# Altium schematic sheet Revision History.SchDoc: Title
size A3; Date: *******; ApprovedBy: *******; CheckedBy: None; Author: *******; CompanyName: *******; DrawnBy: Name; Engineer: *******; Organization: *******; Address1: *******; Address2: *******; Address3: *******; Address4: *******; DocumentNumber: Doc Num; Revision: *******; SheetNumber: 1; SheetTotal: *******; CurrentTime: *******; CurrentDate: *******; Time: *******; DocumentFullPathAndName: *******; DocumentName: *******; ModifiedDate: *******; ImagePath: *******; ProjectName: *******; Application_BuildNumber: *******
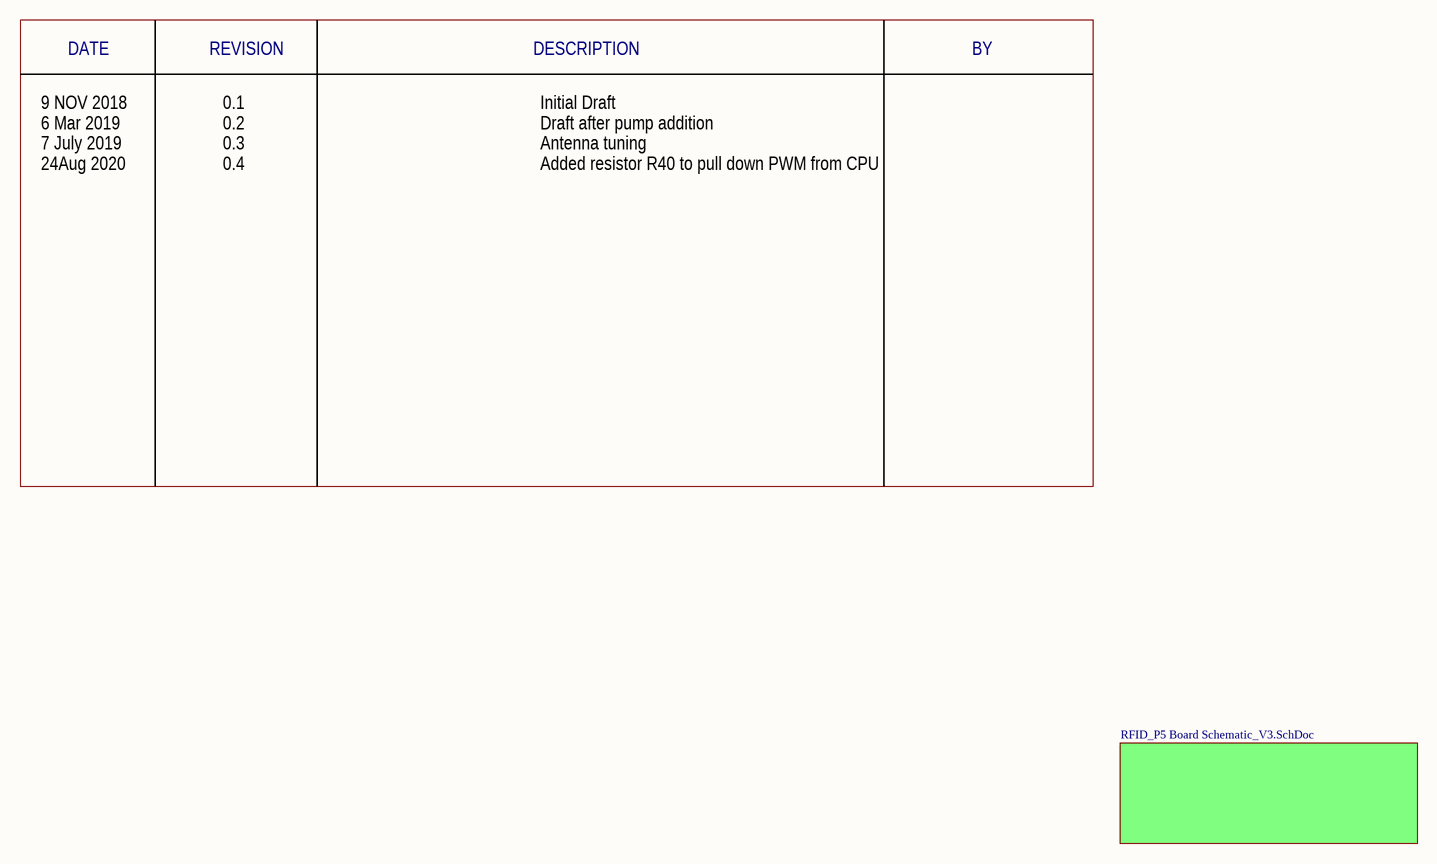
[diagram p0: Revision History.SchDoc]

## Sub-sheets
? = RFID_P5 Board Schematic_V3.SchDoc: no entries

## Notes on the sheet
- DATE
- REVISION
- DESCRIPTION
- BY
- 9 NOV 2018
- 6 Mar 2019
- 0.1
- 0.2
- Initial Draft
- Draft after pump addition
- 7 July 2019
- 24Aug 2020
- 0.3
- 0.4
- Antenna tuning
- Added resistor R40 to pull down PWM from CPU
- Title:
- Drawn By:
- Page Contents:
- Ahmed - AA
- Checked By:
- Size:
- Date:
- File:
- License:
- Email:
- A4
- Number:
- Time:
- Revision:
- Sheet
- Website:
- of